# EAGLE design 4-Flowmeter (EAGLE 7.7.0)
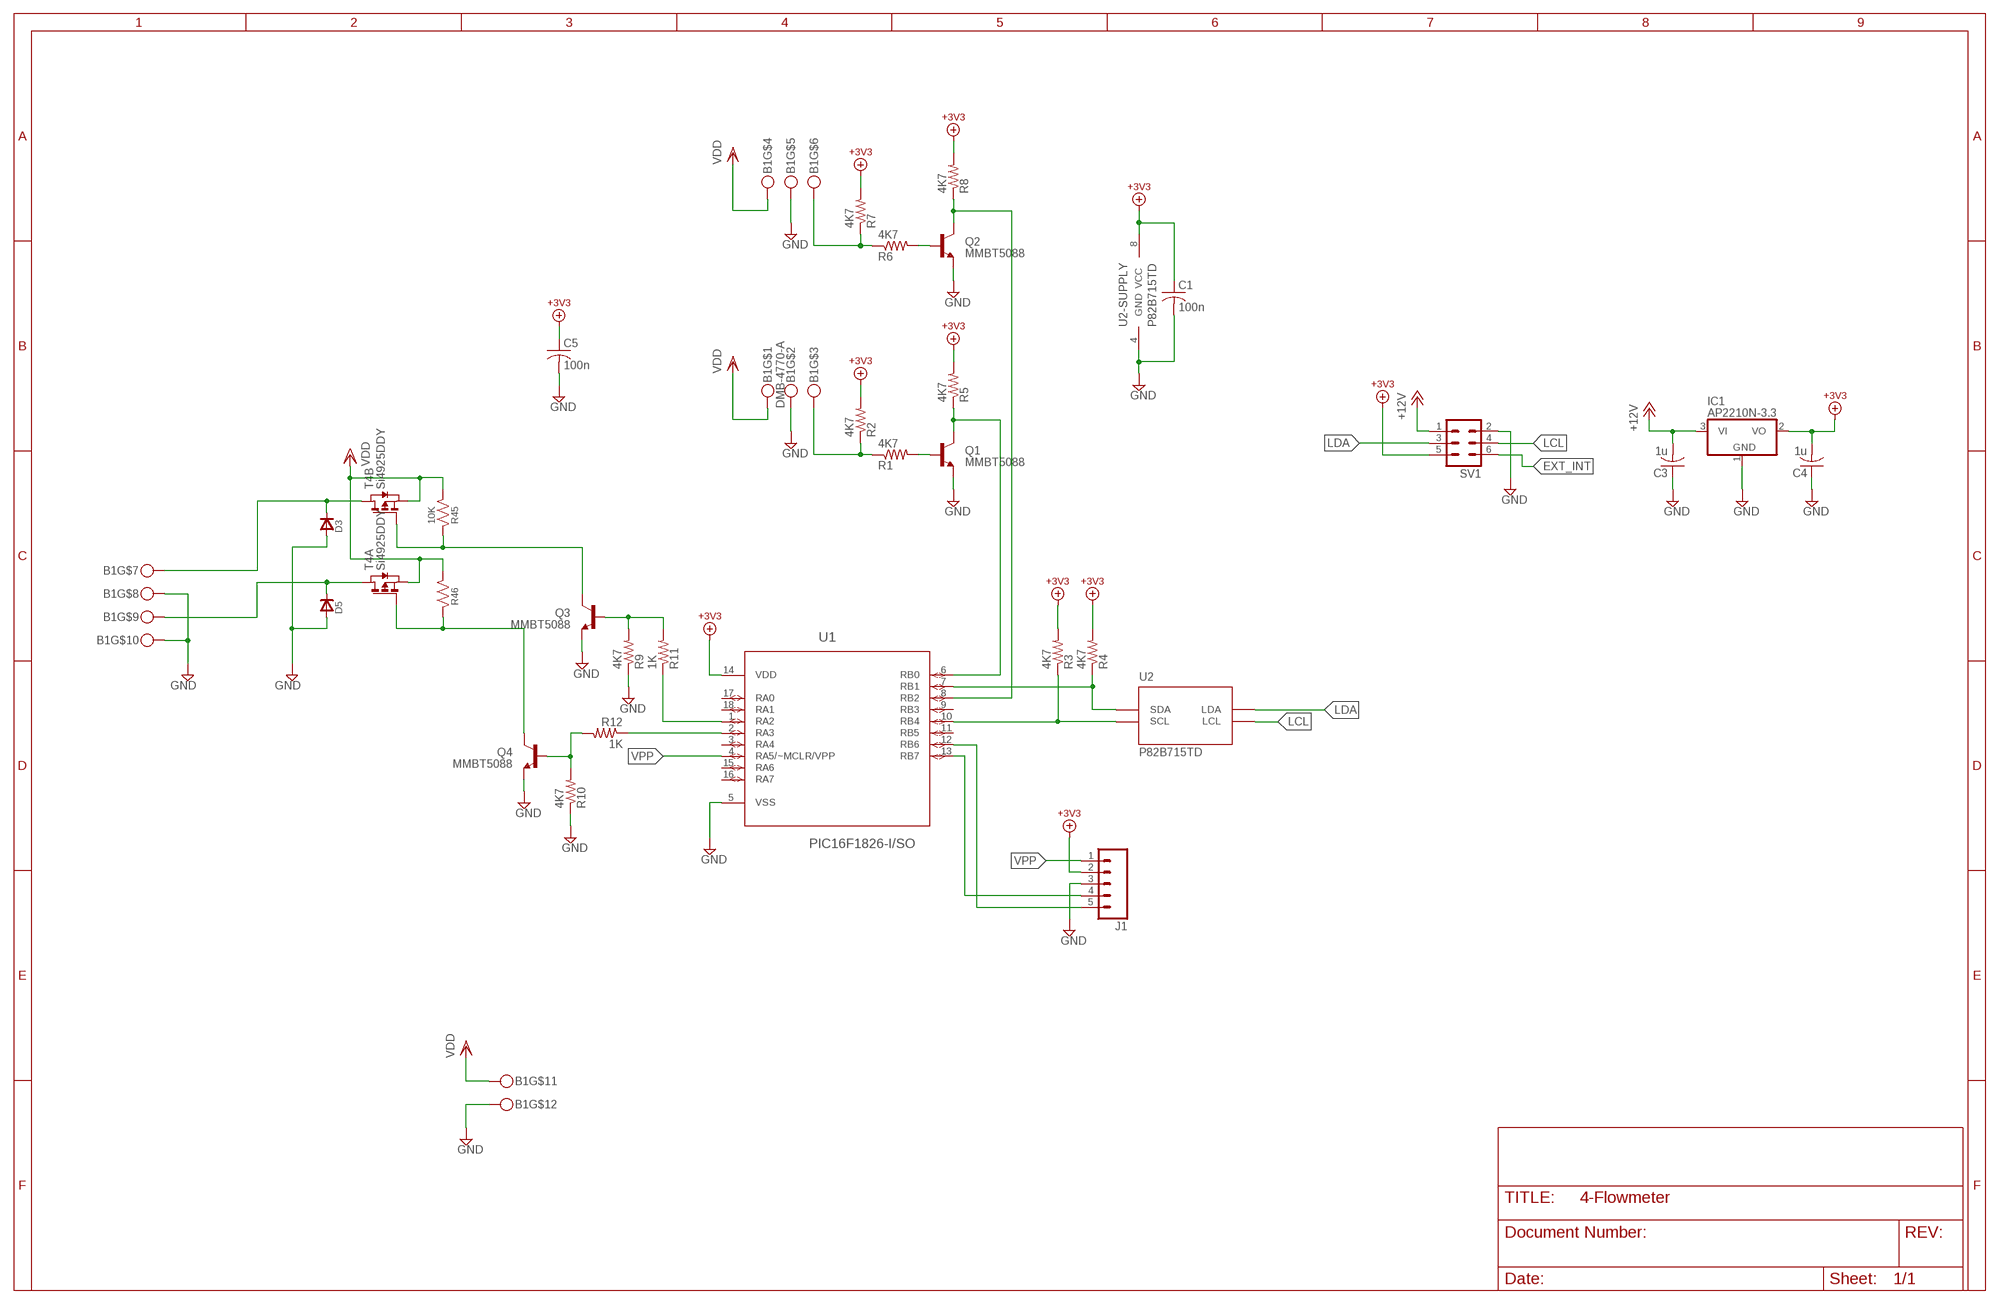
[diagram p0: schematic, sheet 1]

## Parts
B1  DMB-4770-A  [DMB-4770-A-PKG]
C1  100n  C-USC0805  [C0805]
C3  1u  C-USC0805  [C0805]
C4  1u  C-USC0805  [C0805]
C5  100n  C-USC0805  [C0805]
D3  DSMA  [DSMA]
D5  DSMA  [DSMA]
IC1  AP2210N-3.3  MCP1703CB  [SOT23]
J1  M05PTH  [1X05]
Q1  MMBT5088  TRANSISTOR_NPNMMBT5088  [SOT23-3]
Q2  MMBT5088  TRANSISTOR_NPNMMBT5088  [SOT23-3]
Q3  MMBT5088  TRANSISTOR_NPNMMBT5088  [SOT23-3]
Q4  MMBT5088  TRANSISTOR_NPNMMBT5088  [SOT23-3]
R1  4K7  R-US_R0805  [R0805]
R2  4K7  R-US_R0805  [R0805]
R3  4K7  R-US_R0805  [R0805]
R4  4K7  R-US_R0805  [R0805]
R5  4K7  R-US_R0805  [R0805]
R6  4K7  R-US_R0805  [R0805]
R7  4K7  R-US_R0805  [R0805]
R8  4K7  R-US_R0805  [R0805]
R9  4K7  R-US_R0805  [R0805]
R10  4K7  R-US_R0805  [R0805]
R11  1K  R-US_R0805  [R0805]
R12  1K  R-US_R0805  [R0805]
R45  10K  RU0805  [R0805]
R46  RU0805  [R0805]
SV1  ML6  [ML6]
T4  Si4925DDY  PMOS2SO8  [SO8]
U1  PIC16F1826-I/SO  [SOIC127P1030X175-18N]
U2  P82B715TD  [SOIC-8]

## Nets
+3V3: C1.1 C4.2 C5.1 IC1.2(VO) J1.2 R2.2 R3.2 R4.2 R5.2 R7.2 R8.2 SV1.5 U1.14(VDD) U2.8(VCC) ; supply symbol labelled V+3V3
+12VBUS: C3.2 IC1.3(VI) SV1.1 ; supply symbol labelled +12V
EXT_INT: SV1.6
GND: B1.P$2 B1.P$5 B1.P$8 B1.P$10 B1.P$12 C1.2 C3.1 C4.1 C5.2 D3.A D5.A IC1.1(GND) J1.3 Q1.2(E) Q2.2(E) Q3.2(E) Q4.2(E) R9.1 R10.1 SV1.2 U1.5(VSS) U2.4(GND)
LCL: SV1.4 U2.2(LCL)
LDA: SV1.3 U2.7(LDA)
N$1: Q2.1(B) R6.2
N$2: Q1.1(B) R1.2
N$3: B1.P$3 R1.1 R2.1
N$4: Q1.3(C) R5.1 U1.6(RB0)
N$5: J1.4 U1.13(RB7)
N$6: J1.5 U1.12(RB6)
N$8: B1.P$6 R6.1 R7.1
N$9: Q2.3(C) R8.1 U1.8(RB2)
N$10: Q4.3(C) R46.1 T4.2(A:G)
N$11: Q3.1(B) R9.2 R11.2
N$12: R11.1 U1.1(RA2)
N$13: R12.1 U1.2(RA3)
N$14: Q4.1(B) R10.2 R12.2
N$41: R3.1 U1.10(RB4) U2.3(SCL)
N$42: R4.1 U1.7(RB1) U2.6(SDA)
N$80: Q3.3(C) R45.1 T4.4(B:G)
N$95: B1.P$7 D3.C T4.5(B:D) T4.6(B:D)
N$96: B1.P$9 D5.C T4.7(A:D) T4.8(A:D)
VDD: B1.P$1 B1.P$4 B1.P$11 R45.2 R46.2 T4.1(A:S) T4.3(B:S)
VPP: J1.1 U1.4(RA5/~MCLR/VPP)
Unconnected: U1.3(RA4) U1.9(RB3) U1.11(RB5) U1.15(RA6) U1.16(RA7) U1.17(RA0) U1.18(RA1)

## Library data of the parts
B1 = Cedric:DMB-4770-A
C1 C3-C5 = resistor:C-US: CAPACITOR, American symbol
D3 D5 = diodes:D: Diode
IC1 = linear:MCP1703: 250 mA, 16V, Low Quiescent Current LDO Regulator Source: http://ww1.microchip.com/downloads/en/DeviceDoc/22049b.pdf
J1 = SparkFun-Connectors:M05: Header 5 Standard 5-pin 0.1" header. Use with straight break away headers (SKU : PRT-00116), right angle break away headers (PRT-00553), swiss pins (PRT-00743), machine pins (PRT-00117), and female headers (PRT-00115). Molex polarized connector foot print use with SKU : PRT-08230 with associated crimp pins and housings.
Q1-Q4 = SparkFun-DiscreteSemi:TRANSISTOR_NPN: Generic NPN BJT MMBT2222A - TRANS-08049 (SOT-23, 1A 40V) MPSA42 - TRANS-09116 (SOT-23, 500mA 300V) MMBT5088LT1G - TRANS-11160 (SOT-23, 50 mA 30V) BC547 - COM-08928 <http://www.sparkfun.com/products/8928> (TO-92 45V 100mA) (1.Collector 2.Base 3.Emitter) 2N3904 - COM-00521 <http://www.sparkfun.com/products/521> (TO-92 40V 200mA) (1.Emitter 2.Base 3.Collector) P2N2222A - COM-12852 <http://www.sparkfun.com/products/12852> (TO-92 40V 600mA) (1.Collector 2.Base 3.Emitter); PROD_ID: TRANS-11160
R1-R12 = resistor:R-US_: RESISTOR, American symbol
R45 R46 = divers:RU: Resistor, US symbol
SV1 = con-harting-ml:ML6: HARTING; OC_FARNELL: unknown; OC_NEWARK: unknown
T4 = zetex:PMOS2: DUAL 30V P-CHANNEL ENHANCEMENT MODE MOSFET Source: Data sheet <http://www.diodes.com/datasheets/ZXMP3A16DN8.pdf> SOP8 Source: Data sheet <http://www.diodes.com/datasheets/ZXMD63P03X.pdf> MSOP8; OC_FARNELL: unknown; OC_NEWARK: unknown
U1 = Microchip_By_element14_Batch_1:PIC16F1826-I/SO: Flash Microcontrollers; DESCRIPTION: Flash Microcontrollers; MPN: PIC16F1826-I/SO; OC_FARNELL: 1778443; OC_NEWARK: 24R7065; PACKAGE: SOIC-18; SUPPLIER: Microchip Technology
U2 = Volks73-NXPSemiconductors:P82B715?: I2C-Bus Extender I2C-bus extender Documentation Datasheet <http://www.nxp.com/documents/data_sheet/P82B715.pdf> General Description The P82B715 is a bipolar IC intended for application in I2C-bus and derivative bus systems. While retaining all the operating modes and features of the I2C-bus it permits extension of the practical separation distance between components on the I2C-bus by buffering both the data (SDA) and the clock (SCL) lines. The I2C-bus capacitance limit of 400 pF restricts practical communication distances to a few meters. Using one P82B715 at each end of a long cable (connecting Lx/Ly to Lx/Ly) reduces that cable’s loading on the linked I2C-buses by a factor of 10 and allows the total system capacitance load (all devices, cable, connectors, and traces or wires connected to the I2C-bus) to be around 3000 pF while the loading on each I2C-bus on the Sx/Sy sides remains below 400 pF. Longer cables or low-cost, general-purpose wiring may be used to link I2C-bus based modules without degrading noise margins. Multiple P82B715s can be connected together, linking their Lx/Ly ports, in a star or multi-point architecture as long as the total capacitance of the system is less than about 3000 pF and each bus at an Sx/Sy connection is well below 400 pF. This configuration, with the master and/or slave devices attached to the Sx/Sy port of each P82B715, has full multi-master communication capability. The P82B715 alone does not support voltage level translation, but it can be simply implemented using low cost transistors when required. There is no restriction on interconnecting the Sx/Sy I/Os, and, because the device output levels are always held within 100 mV of input drive levels, P82B715 is compatible with bus buffers that use voltage level offsets, e.g., PCA9511A, PCA9517, Sx/Sy side of P82B96. The lower VOL level and ability to operate with any master, slave or bus buffer is the primary advantage of the using the P82B715 for long distance buses at the disadvantage of not isolating bus capacitance like the P82B96 or PCA9600 are able to do. The primary disadvantage of the P82B96 and PCA9600 is that the static level offset needed to isolate bus capacitance does not allow these devices to operate with other bus buffers with special offset levels or with master/slaves that require a VIL lower than 0.8 V with noise margin. A proven quick design-in point-to-point/multi-point circuit (Figure 9) is included in Section 8.2 to allow rapid use of the P82B715 along with comparison waveforms so that the designer can clearly see the trade-offs between the P82B715 and the P82B96/PCA9600 and choose the type of device that is best for their application. Features Dual, bidirectional, unity voltage gain buffer with no external directional control required Compatible with I2C-bus and its derivatives SMBus, PMBus, DDC, etc. Logic signal levels may include (but not exceed) both supply and ground Logic signal input voltage levels are output without change and are independent of VCC ×10 impedance transformation, but does not change logic voltage levels Supply voltage range 3 V to 12 V Clock speeds to at least 100 kHz and 400 kHz when other system delays permit ESD protection exceeds 2500 V HBM per Mil. Std 883C-3015.7 and 400 V MM per JESD22-A115 (I/Os have diodes to VCC and GND) Latch-up testing is done to JEDEC Standard JESD78 which exceeds 100 mA Applications Increase the total connected capacitance of an I2C-bus system to around 3000 pF Drive I2C-bus signals over long cables to approximately 50 meters or 3000 pF Drives ×10 lower impedance bus wiring for improved noise immunity Multi-drop distribution of I2C-bus signals using low cost twisted-pair cables AdvancedTCA radial IPMB architecture Driving 30 mA Fm+ devices from standard 3 mA parts; APPLICATIONS: I2C; CAPACITANCE-INPUT: 3000pF; CURRENT_SUPPLY: 22mA; DATA_RATE: 400kHz; DELAY_TIME: -; DESCRIPTION: IC REDRIVER I2C 1CH 400KHZ 8SO; DOCUMENTATION_LINK: <a href="http://www.nxp.com/documents/data_sheet/P82B715.pdf">Datasheet</a>; DOCUMENTATION_URL: http://www.nxp.com/documents/data_sheet/P82B715.pdf; INPUT: 2-Wire Buse; MANUFACTURER: NXP Semiconductors; NUMBER_OF_CHANNELS: 1; OPERATING_TEMPERATURE: -40C ~ 85C; OUTPUT: 2-Wire Bus; PART_NUMBER: P82B715TD,118; SIGNAL_CONDITIONING: -; SUPPLIER_ITEM_LINK: <a href="http://www.digikey.com/product-detail/en/P82B715TD,118/568-1007-2-ND/735621">Details</a>; SUPPLIER_ITEM_NUMBER: 568-1007-2-ND; SUPPLIER_ITEM_URL: http://www.digikey.com/product-detail/en/P82B715TD,118/568-1007-2-ND/735621; SUPPLIER_LINK: <a href="http://www.digikey.com">Home Page</a>; SUPPLIER_NAME: Digi-Key; SUPPLIER_URL: http://www.digikey.com; TYPE: Buffer, ReDriver; VOLTAGE_SUPPLY: 4.5V ~ 12V

## Board
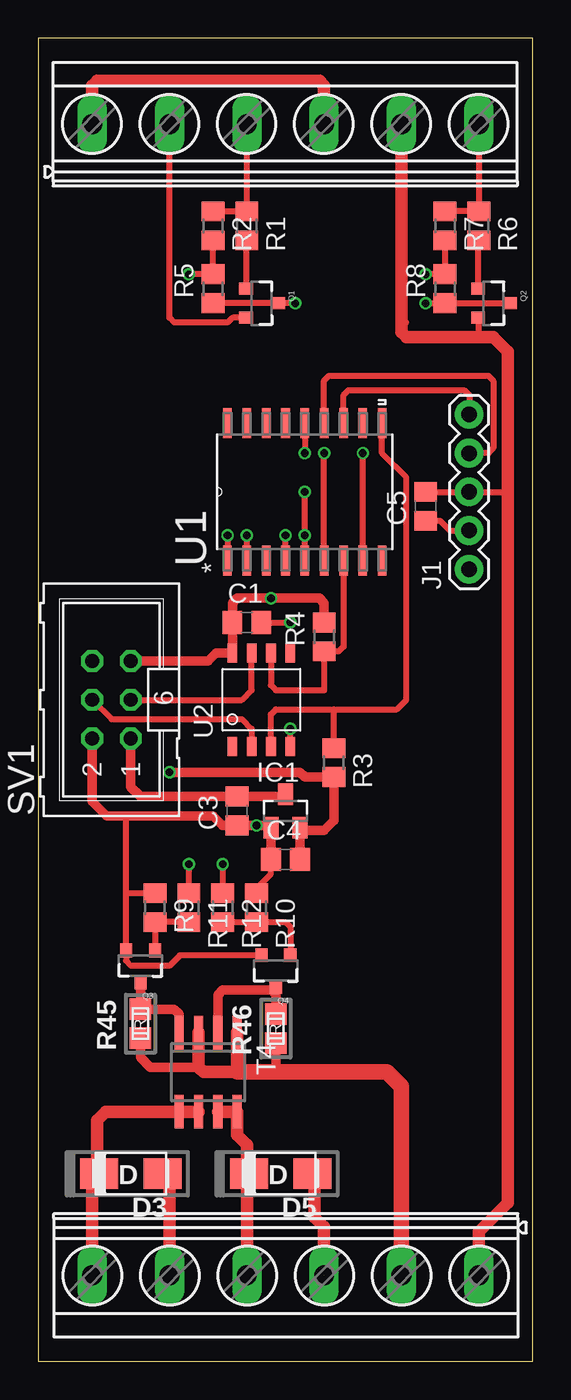
[diagram p1: board, top side]
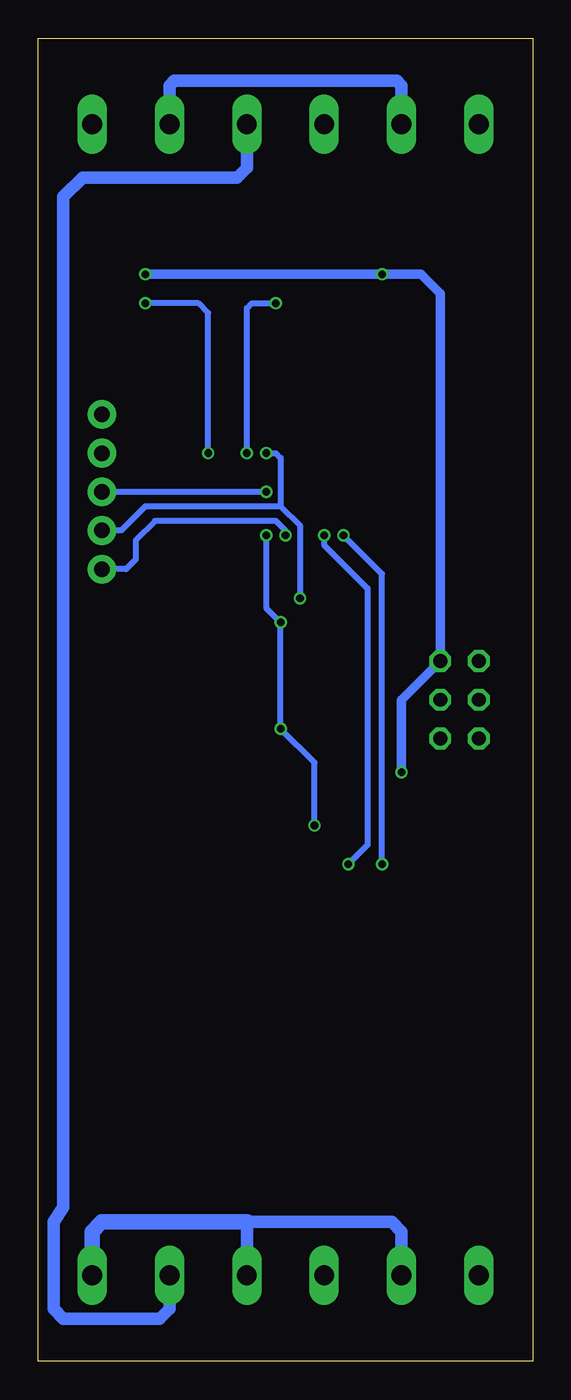
[diagram p2: board, bottom side, seen from below]

Size 32.51 x 86.89 mm. Coordinates in mm from the lower left corner, seen from the top.
Copper layers (1*16): Top 0.035mm / dielectric 1.5mm / Bottom 0.035mm
Design rules "ITEADstudio_DRC": minimum track width 6mil, minimum drill 12mil, track to track 6mil, track to pad 6mil, pad to pad 6mil, via to via 6mil, smd to smd 0mil, copper to edge 10mil, drill to drill 10mil, minimum pad ring 10mil, minimum via ring 6mil, stop-mask expansion 2mil, vias tented up to drill 100mil, thermal gap 10mil

### Footprints (pad centres in the part's own frame; a part is rotated, then mirrored left to right if it is on the bottom)
DMB-4770-A-PKG = drill 1.3 long: P$1 -12.7,37.795; P$2 -7.62,37.795; P$3 -2.54,37.795; P$4 2.54,37.795; P$5 7.62,37.795; P$6 12.7,37.795; P$7 -12.7,-37.795; P$8 -7.62,-37.795; P$9 -2.54,-37.795; P$10 2.54,-37.795; P$11 7.62,-37.795; P$12 12.7,-37.795
C0805 = smd 1.3 x 1.5: 1 -0.95,0; 2 0.95,0
DSMA = smd 2.5 x 2: A -2.083,0; C 2.083,0
SOT23 = smd 1 x 1.4: 1 -0.95,-1.1; 2 0.95,-1.1; 3 0,1.1
1X05 = drill 1.016 pad 1.88: 1 0,0; 2 2.54,0; 3 5.08,0; 4 7.62,0; 5 10.16,0
SOT23-3 = smd 0.8 x 0.9: 1 -0.95,-1; 2 0.95,-1; 3 0,1.1
R0805 = smd 1.3 x 1.5: 1 -0.95,0; 2 0.95,0
R0805' = smd 1.397 x 1.397: 1 -0.953,0; 2 0.953,0
ML6 = drill 0.914 octagon: 1 -2.54,-1.27; 2 -2.54,1.27; 3 0,-1.27; 4 0,1.27; 5 2.54,-1.27; 6 2.54,1.27
SO8 = smd 0.6 x 2.2: 1 -1.905,-2.6; 2 -0.635,-2.6; 3 0.635,-2.6; 4 1.905,-2.6; 5 1.905,2.6; 6 0.635,2.6; 7 -0.635,2.6; 8 -1.905,2.6
SOIC127P1030X175-18N = smd 1.981 x 0.559: 1 -4.521,5.08; 2 -4.521,3.81; 3 -4.521,2.54; 4 -4.521,1.27; 5 -4.521,0; 6 -4.521,-1.27; 7 -4.521,-2.54; 8 -4.521,-3.81; 9 -4.521,-5.08; 10 4.521,-5.08; 11 4.521,-3.81; 12 4.521,-2.54; 13 4.521,-1.27; 14 4.521,0; 15 4.521,1.27; 16 4.521,2.54; 17 4.521,3.81; 18 4.521,5.08
SOIC-8 = smd 1.27 x 0.635: 1 -3.073,1.905; 2 -3.073,0.635; 3 -3.073,-0.635; 4 -3.073,-1.905; 5 3.073,-1.905; 6 3.073,-0.635; 7 3.073,0.635; 8 3.073,1.905

### Placement (x,y rotation side)
B1  16.26,43.45 0 top
C1  13.72,48.53 0 top
C3  13.08,36.14 90 top
C4  16.26,32.97 0 top
C5  25.46,56.15 90 top
D3  6.1,12.33 180 top
D5  15.94,12.33 180 top
IC1  16.26,36.14 0 top
J1  28.32,52.02 90 top
Q1  14.67,69.48 270 top
Q2  29.91,69.48 270 top
Q3  6.73,25.98 180 top
Q4  15.62,25.67 180 top
R1  13.72,74.56 270 top
R2  11.49,74.56 270 top
R3  19.43,39.32 270 top
R4  18.8,47.57 90 top
R5  11.49,70.43 90 top
R6  28.96,74.56 270 top
R7  26.73,74.56 270 top
R8  26.73,70.43 90 top
R9  7.68,29.79 270 top
R10  14.35,29.79 270 top
R11  9.91,29.79 270 top
R12  12.13,29.79 270 top
R45  10K  [R0805']  6.73,22.17 270 top
R46  [R0805']  15.62,21.86 270 top
SV1  4.83,43.45 90 top
T4  11.18,19 180 top
U1  17.53,57.1 90 top
U2  14.67,43.45 90 top

### Tracks (layer width: path | path; a pad name or v marks a point on that pad's centre or on a via)
+3V3  (via drill 0.5)
  Top 0.406: C1.1 | R4.2 | 17.38,34.87 IC1.2 | R2.2 R5.2 v9.91,71.38 v9.91,71.39 | U1.14 v17.53,59.64 | C5.1 26.41,55.2 27.05,54.56 J1.2 | R7.2 R8.2 v25.47,71.38 v25.46,71.39
  Top 0.61: IC1.2 C4.2 | SV1.5 11.18,45.99 11.71,46.52 U2.8 C1.1 | 17.38,34.87 18.8,34.87 19.43,35.51 R3.2 17.52,38.37 17.21,38.68 v8.64,38.68 | C1.1 12.77,49.8 13.08,50.11 v15.3,50.11 18.48,50.11 18.8,49.8 R4.2
  Bottom 0.406: v17.53,59.64 16.89,59.64 16.57,59.32 16.57,56.15 | 16.57,56.15 25.46,56.15 27.05,54.56 J1.2 | 16.57,56.15 15.3,54.88 v15.3,50.11
  Bottom 0.61: v8.64,38.68 8.64,43.45 SV1.5 6.1,70.12 7.37,71.39 v9.91,71.39 v25.46,71.39
+12VBUS
  Top 0.406: C3.2 | 16.11,37.09 IC1.3
  Top 0.61: SV1.1 6.1,37.73 6.73,37.1 C3.2 | C3.2 16.11,37.09
GND  (via drill 0.5)  (2 unrouted)
  Top 0.406: C3.1 | 15.16,35.19 IC1.1 | C5.2 J1.3 | J1.3 | U1.5 v17.53,54.24 v17.53,57.1 | C1.2 v16.57,48.53 | U2.4 v16.57,41.54 | B1.P$2 8.64,68.53 8.95,68.21 12.45,68.21 12.77,68.53 Q1.2 | 24.19,68.21 23.88,68.53 | 14.35,31.06 15.3,32.02 C4.1 | Q4.2 9.32,26.67 8.64,25.98 6.1,25.98 5.78,26.3 5.78,26.62 Q3.2 5.78,30.75 | 5.78,30.75 5.78,35.82 | Q2.2 28.91,67.31 28.96,67.26 | J1.3 30.86,57.1 | R9.1 5.78,30.74 5.78,30.75
  Top 0.61: SV1.2 3.56,36.78 4.51,35.83 5.78,35.83 | 5.78,35.83 11.49,35.83 12.13,35.19 C3.1 | C3.1 v14.35,35.19 15.16,35.19 | IC1.1 C4.1 | R10.1 14.35,31.06 | 5.78,35.82 5.78,35.83
  Top 0.813: B1.P$5 23.88,68.53 23.88,67.58 24.19,67.26 28.96,67.26 29.91,67.26 30.86,66.31 30.86,57.1 30.86,10.43 28.96,8.52 28.96,5.66 | B1.P$8 8.64,11.87 D3.A | B1.P$10 18.8,8.84 18.16,9.47 18.16,12.19 D5.A
  Bottom 0.406: v17.53,57.1 J1.3 | v17.53,54.24 17.53,49.48 v16.57,48.53 v16.57,41.54 14.35,39.32 v14.35,35.19
  Bottom 0.813: B1.P$2 8.64,83.77 8.95,84.09 23.56,84.09 23.88,83.77 B1.P$5 | B1.P$8 8.64,8.52 9.27,9.16 18.8,9.16 18.8,5.66
  Bottom 1.016: B1.P$12 28.96,8.52 28.32,9.16 18.8,9.16
LCL
  Top 0.406: SV1.4 4.83,42.18 13.4,42.18 14.03,41.54 U2.2
LDA
  Top 0.406: SV1.3 13.4,43.45 14.03,44.08 U2.7
N$1
  Top 0.406: Q2.1 28.91,73.56 R6.2
N$2
  Top 0.406: R1.2 13.67,73.61 Q1.1
N$3
  Top 0.406: R2.1 R1.1 B1.P$3
N$4  (via drill 0.5)
  Top 0.406: R5.1 Q1.3 v16.89,69.48 | U1.6 v18.8,59.64
  Bottom 0.406: v18.8,59.64 18.8,69.16 18.48,69.48 v16.89,69.48
N$5
  Top 0.406: U1.13 18.8,64.4 19.11,64.72 29.59,64.72 29.91,64.4 29.91,59.96 29.59,59.64 J1.4
N$6
  Top 0.406: U1.12 20.07,63.45 20.38,63.77 28,63.77 28.32,63.45 J1.5
N$8
  Top 0.406: B1.P$6 R6.1 R7.1
N$9  (via drill 0.5)
  Top 0.406: Q2.3 R8.1 v25.46,69.48 | U1.8 v21.34,59.64
  Bottom 0.406: v21.34,59.64 21.34,68.85 21.97,69.48 v25.46,69.48
N$10
  Top 0.61: Q4.3 15.62,24.08 | 15.62,24.08 R46.1 | T4.2 11.81,24.08 12.13,24.4 15.3,24.4 15.62,24.08
N$11
  Top 0.406: Q3.1 R9.2 R11.2
N$12  (via drill 0.5)
  Top 0.406: R11.1 v9.91,32.65 | v12.45,54.24 U1.1
  Bottom 0.406: v9.91,32.65 9.91,51.7 v12.45,54.24
N$13  (via drill 0.5)
  Top 0.406: U1.2 v13.72,54.24 | v12.13,32.65 R12.1
  Bottom 0.406: v13.72,54.24 13.72,53.61 10.86,50.75 10.86,33.92 v12.13,32.65
N$14
  Top 0.406: R12.2 R10.2 16.25,28.84 16.57,28.52 Q4.1
N$41
  Top 0.406: U2.3 15.3,42.49 15.62,42.81 19.43,42.81 | R3.1 19.43,42.81 | 19.43,42.81 23.56,42.81 24.19,43.45 24.19,58.05 22.61,59.64 U1.10
N$42
  Top 0.406: U2.6 15.3,44.4 15.62,44.08 18.8,44.08 R4.1 19.75,46.62 20.07,46.94 U1.7
N$80
  Top 0.61: Q3.3 6.73,22.81 R45.1 8.95,23.13 9.27,22.81 T4.4
N$95
  Top 0.813: B1.P$7 3.56,11.87 D3.C 3.87,12.47 3.87,15.82 4.45,16.4 T4.5 T4.6
N$96
  Top 0.813: T4.7 T4.8 13.08,14.87 13.72,14.24 13.72,12.47 D5.C 13.72,12.19 B1.P$9
VDD
  Top 0.61: R46.2 15.62,19 | R45.2 6.73,19.95 7.37,19.32 10.54,19.32
  Top 0.813: B1.P$1 3.56,83.77 3.87,84.09 18.48,84.09 18.8,83.77 B1.P$4 | T4.3 10.54,19.32 10.86,19 13.08,19 T4.1
  Top 1.016: B1.P$11 23.88,18.05 22.92,19 15.62,19 13.08,19
  Bottom 0.813: B1.P$4 18.8,78.37 19.43,77.74 29.59,77.74 30.86,76.47 30.86,10.11 31.5,9.16 31.5,3.44 30.86,2.81 24.51,2.81 23.88,3.44 B1.P$11
VPP  (via drill 0.5)
  Top 0.406: U1.4 v16.26,54.24
  Bottom 0.406: v16.26,54.24 16.26,54.56 16.89,55.19 24.83,55.19 26.1,53.92 26.1,52.65 26.73,52.02 J1.1